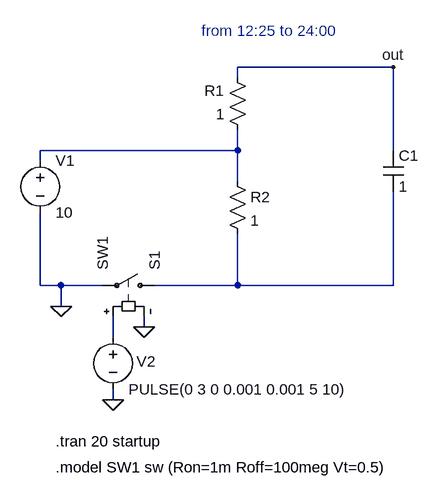
[diagram p0: schematic part4.asc]
part4.asc, the LTspice schematic file:
Version 4
SHEET 1 1256 696
WIRE 560 64 320 64
WIRE 320 80 320 64
WIRE 320 192 320 160
WIRE 320 192 16 192
WIRE 560 192 560 64
WIRE 16 208 16 192
WIRE 320 240 320 192
WIRE 16 400 16 288
WIRE 48 400 16 400
WIRE 112 400 48 400
WIRE 320 400 320 320
WIRE 320 400 192 400
WIRE 560 400 560 256
WIRE 560 400 320 400
WIRE 48 432 48 400
WIRE 176 464 176 448
WIRE 128 480 128 448
WIRE 128 576 128 560
FLAG 560 64 out
FLAG 48 432 0
FLAG 128 576 0
FLAG 176 464 0
SYMBOL sw 208 400 M270
SYMATTR InstName S1
SYMATTR Value SW1
SYMBOL voltage 16 192 R0
SYMATTR InstName V1
SYMATTR Value 10
SYMBOL res 336 176 R180
WINDOW 0 36 76 Left 2
WINDOW 3 36 40 Left 2
SYMATTR InstName R1
SYMATTR Value 1
SYMBOL cap 544 192 R0
SYMATTR InstName C1
SYMATTR Value 1
SYMBOL voltage 128 464 R0
WINDOW 0 36 53 Left 2
SYMATTR InstName V2
SYMATTR Value PULSE(0 3 0 0.001 0.001 5 10)
SYMBOL res 304 224 R0
SYMATTR InstName R2
SYMATTR Value 1
TEXT 40 640 Left 2 !.tran 20 startup
TEXT 40 680 Left 2 !.model SW1 sw (Ron=1m Roff=100meg Vt=0.5)
TEXT 264 8 Left 2 ;from 12:25 to 24:00

The netlist it stands for:
* part4.asc
S1 N002 0 N003 0 SW1
V1 N001 0 10
R1 N001 out 1
C1 out N002 1
V2 N003 0 PULSE(0 3 0 0.001 0.001 5 10)
R2 N001 N002 1
.tran 20 startup
.model SW1 sw (Ron=1m Roff=100meg Vt=0.5)
* from 12:25 to 24:00
.backanno
.end